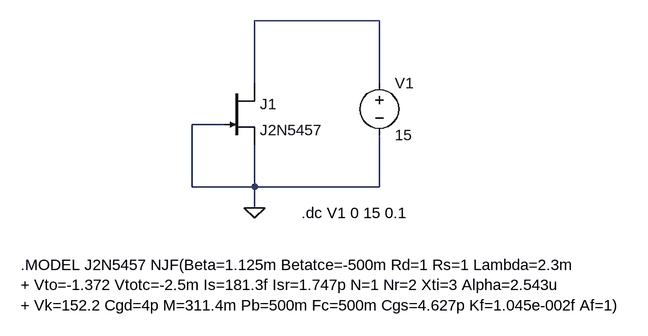
[diagram p0: schematic saturacion.asc]
saturacion.asc, the LTspice schematic file:
Version 4.1
SHEET 1 3080 680
WIRE 400 16 208 16
WIRE 208 112 208 16
WIRE 400 112 400 16
WIRE 160 176 112 176
WIRE 112 272 112 176
WIRE 208 272 208 208
WIRE 208 272 112 272
WIRE 400 272 400 192
WIRE 400 272 208 272
WIRE 208 304 208 272
FLAG 208 304 0
SYMBOL njf 160 112 R0
SYMATTR InstName J1
SYMATTR Value J2N5457
SYMBOL voltage 400 96 R0
SYMATTR InstName V1
SYMATTR Value 15
TEXT -152 392 Left 2 !.MODEL J2N5457 NJF(Beta=1.125m Betatce=-500m Rd=1 Rs=1 Lambda=2.3m\n+ Vto=-1.372 Vtotc=-2.5m Is=181.3f Isr=1.747p N=1 Nr=2 Xti=3 Alpha=2.543u\n+ Vk=152.2 Cgd=4p M=311.4m Pb=500m Fc=500m Cgs=4.627p Kf=1.045e-002f Af=1)
TEXT 280 312 Left 2 !.dc V1 0 15 0.1

The netlist it stands for:
* saturacion.asc
J1 N001 0 0 J2N5457
V1 N001 0 15
.model NJF NJF
.model PJF PJF
.lib standard.jft
.MODEL J2N5457 NJF(Beta=1.125m Betatce=-500m Rd=1 Rs=1 Lambda=2.3m
+ Vto=-1.372 Vtotc=-2.5m Is=181.3f Isr=1.747p N=1 Nr=2 Xti=3 Alpha=2.543u
+ Vk=152.2 Cgd=4p M=311.4m Pb=500m Fc=500m Cgs=4.627p Kf=1.045e-002f Af=1)
.dc V1 0 15 0.1
.backanno
.end